# Altium schematic sheet BatteryCharger.SchDoc
size A3; SheetNumber: 2; SheetTotal: 5
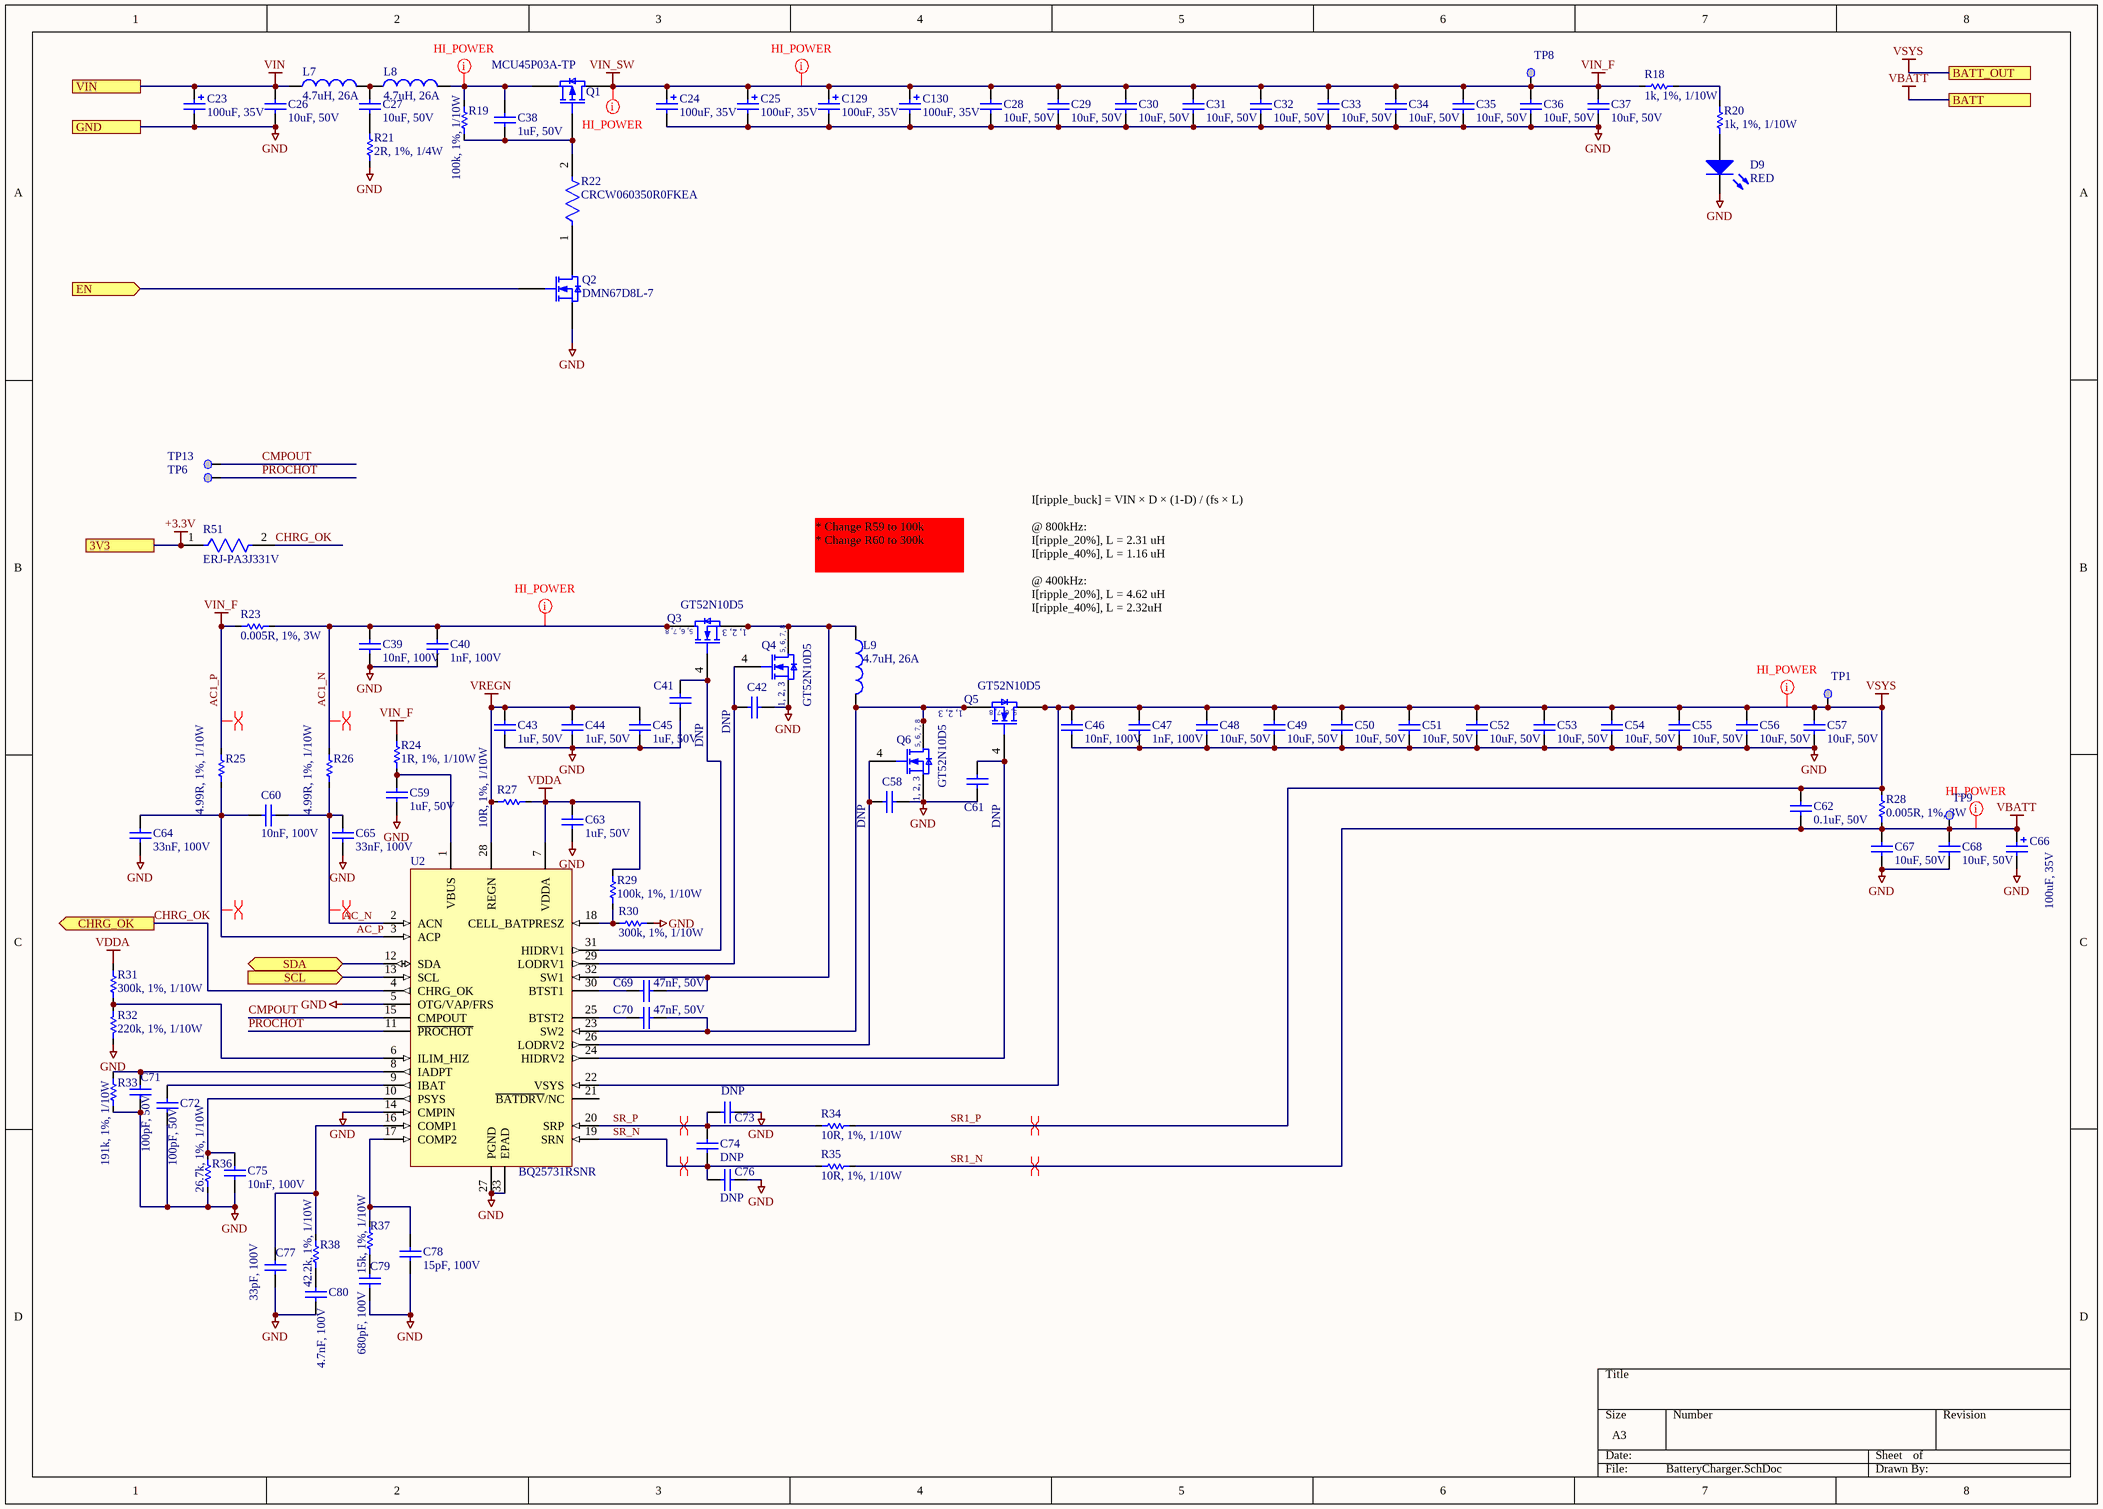
[diagram p0: BatteryCharger.SchDoc]

## Parts
C23  100uF, 35V  [CAPAE7866X80L]
C24  100uF, 35V  [CAPAE7866X80L]
C25  100uF, 35V  [CAPAE7866X80L]
C26  10uF, 50V  [1206]
C27  10uF, 50V  [1206]
C28  10uF, 50V  [1206]
C29  10uF, 50V  [1206]
C30  10uF, 50V  [1206]
C31  10uF, 50V  [1206]
C32  10uF, 50V  [1206]
C33  10uF, 50V  [1206]
C34  10uF, 50V  [1206]
C35  10uF, 50V  [1206]
C36  10uF, 50V  [1206]
C37  10uF, 50V  [1206]
C38  1uF, 50V  [0805]
C39  10nF, 100V  [0603]
C40  1nF, 100V  [0603]
C41  DNP  [0603]
C42  DNP  [0603]
C43  1uF, 50V  [0805]
C44  1uF, 50V  [0805]
C45  1uF, 50V  [0805]
C46  10nF, 100V  [0603]
C47  1nF, 100V  [0603]
C48  10uF, 50V  [1206]
C49  10uF, 50V  [1206]
C50  10uF, 50V  [1206]
C51  10uF, 50V  [1206]
C52  10uF, 50V  [1206]
C53  10uF, 50V  [1206]
C54  10uF, 50V  [1206]
C55  10uF, 50V  [1206]
C56  10uF, 50V  [1206]
C57  10uF, 50V  [1206]
C58  DNP  [0603]
C59  1uF, 50V  [0805]
C60  10nF, 100V  [0603]
C61  DNP  [0603]
C62  0.1uF, 50V  [0603]
C63  1uF, 50V  [0805]
C64  33nF, 100V  [0805_CAP]
C65  33nF, 100V  [0805_CAP]
C66  100uF, 35V  [CAPAE7866X80L]
C67  10uF, 50V  [1206]
C68  10uF, 50V  [1206]
C69  47nF, 50V  [0603]
C70  47nF, 50V  [0603]
C71  100pF, 50V  [0603]
C72  100pF, 50V  [0603]
C73  DNP  [0603]
C74  DNP  [0603]
C75  10nF, 100V  [0603]
C76  DNP  [0603]
C77  33pF, 100V  [0603]
C78  15pF, 100V  [0603]
C79  680pF, 100V  [0603]
C80  4.7nF, 100V  [0603]
C129  100uF, 35V  [CAPAE7866X80L]
C130  100uF, 35V  [CAPAE7866X80L]
D9  RED  [0603_DIODE_K1A2]
L7  4.7uH, 26A  [INDM178169X70N]
L8  4.7uH, 26A  [INDM178169X70N]
L9  4.7uH, 26A  [INDM178169X70N]
Q1  MCU45P03A-TP  [DPAK]
Q2  DMN67D8L-7  [SOT23-3]
Q3  GT52N10D5  [8-PowerSMD]
Q4  GT52N10D5  [8-PowerSMD]
Q5  GT52N10D5  [8-PowerSMD]
Q6  GT52N10D5  [8-PowerSMD]
R18  1k, 1%, 1/10W  [0603]
R19  100k, 1%, 1/10W  [0603]
R20  1k, 1%, 1/10W  [0603]
R21  2R, 1%, 1/4W  [1206]
R22  CRCW060350R0FKEA  [FP-CRCW0603-e3-IPC_A]
R23  0.005R, 1%, 3W  [2512_RES_1]
R24  1R, 1%, 1/10W  [0603]
R25  4.99R, 1%, 1/10W  [0603]
R26  4.99R, 1%, 1/10W  [0603]
R27  10R, 1%, 1/10W  [0603]
R28  0.005R, 1%, 3W  [2512_RES_1]
R29  100k, 1%, 1/10W  [0603]
R30  300k, 1%, 1/10W  [0603]
R31  300k, 1%, 1/10W  [0603]
R32  220k, 1%, 1/10W  [0603]
R33  191k, 1%, 1/10W  [0603]
R34  10R, 1%, 1/10W  [0603]
R35  10R, 1%, 1/10W  [0603]
R36  26.7k, 1%, 1/10W  [0603]
R37  15k, 1%, 1/10W  [0603]
R38  42.2k, 1%, 1/10W  [0603]
R51  ERJ-PA3J331V  [FP-ERJPA3-MFG]
TP1  Test Point  [TEST POINT 40 Mil]  (value not drawn)  (no BOM)
TP6  Test Point  [TEST POINT 40 Mil]  (value not drawn)  (no BOM)
TP8  Test Point  [TEST POINT 40 Mil]  (value not drawn)  (no BOM)
TP9  Test Point  [TEST POINT 40 Mil]  (value not drawn)  (no BOM)
TP13  Test Point  [TEST POINT 40 Mil]  (value not drawn)  (no BOM)
U2  BQ25731RSNR  [QFN40P400X400X80_HS-33L]

## Ports
3V3, BATT, BATT_OUT, CHRG_OK (out), EN (in), GND, SCL (in), SDA (bidir), VIN

## Nets
+3.3V: R51.1 ; port 3V3
AC1_P: C24.1 C25.1 C28.2 C29.2 C30.2 C31.2 C32.2 C33.2 C34.2 C35.2 C36.2 C37.2 C129.1 C130.1 Q1.2(D) R18.2 R23.1 R24.2 R25.2 TP8.1  [also labelled VIN_F, VIN_SW]
GND: C23.2 C24.2 C25.2 C26.1 C28.1 C29.1 C30.1 C31.1 C32.1 C33.1 C34.1 C35.1 C36.1 C37.1 C39.1 C40.1 C41.2 C42.2 C43.1 C44.1 C45.1 C46.1 C47.1 C48.1 C49.1 C50.1 C51.1 C52.1 C53.1 C54.1 C55.1 C56.1 C57.1 C58.2 C59.1 C61.2 C63.1 C64.1 C65.1 C66.2 C67.1 C68.1 C71.2 C72.1 C73.2 C75.1 C76.2 C77.1 C78.1 C79.1 C80.1 C129.2 C130.2 D9.2(K) Q2.2(S) Q4.1(S1) Q4.2(S2) Q4.3(S3) Q6.1(S1) Q6.2(S2) Q6.3(S3) R21.1 R30.1 R32.2 R33.1 R36.1 U2.5(OTG/VAP/FRS) U2.14(CMPIN) U2.27(PGND) U2.33(EPAD) ; port GND
SR1_N: C62.1 C66.1 C67.2 C68.2 R28.1 R35.2 TP9.1 ; port BATT  [also labelled VBATT]
SR1_P: C46.2 C47.2 C48.2 C49.2 C50.2 C51.2 C52.2 C53.2 C54.2 C55.2 C56.2 C57.2 C62.2 Q5.5(D1) Q5.6(D2) Q5.7(D3) Q5.8(D4) R28.2 R34.2 TP1.1 U2.22(VSYS) ; port BATT_OUT  [also labelled VSYS]
VDDA: C63.2 R27.2 R29.2 R31.2 U2.7(VDDA)
VIN: C23.1 C26.2 L7.1 ; port VIN
VREGN: C43.2 C44.2 C45.2 R27.1 U2.28(REGN)
AC1_N: C39.2 C40.2 Q3.5(D1) Q3.6(D2) Q3.7(D3) Q3.8(D4) R23.2 R26.2
AC_N: C60.1 C65.2 R26.1 U2.2(ACN)
AC_P: C60.2 C64.2 R25.1 U2.3(ACP)
CHRG_OK: R51.2 U2.4(CHRG_OK) ; port CHRG_OK
CMPOUT: TP13.1 U2.15(CMPOUT)
EN: Q2.1(G) ; port EN
PROCHOT: TP6.1 U2.11(~{PROCHOT})
SCL: U2.13(SCL) ; port SCL
SDA: U2.12(SDA) ; port SDA
SR_N: C74.1 C76.1 R35.1 U2.19(SRN)
SR_P: C73.1 C74.2 R34.1 U2.20(SRP)
NetC27_1: C27.1 R21.2
NetC27_2: C27.2 L7.2 L8.1
NetC38_1: C38.1 Q1.1(G) R19.1 R22.2
NetC38_2: C38.2 L8.2 Q1.3(S) R19.2
NetC41_1: C41.1 Q3.4(G) U2.31(HIDRV1)
NetC42_1: C42.1 Q4.4(G) U2.29(LODRV1)
NetC58_1: C58.1 Q6.4(G) U2.26(LODRV2)
NetC59_2: C59.2 R24.1 U2.1(VBUS)
NetC61_1: C61.1 Q5.4(G) U2.24(HIDRV2)
NetC69_1: C69.1 L9.1 Q3.1(S1) Q3.2(S2) Q3.3(S3) Q4.5(D1) Q4.6(D2) Q4.7(D3) Q4.8(D4) U2.32(SW1)
NetC69_2: C69.2 U2.30(BTST1)
NetC70_1: C70.1 L9.2 Q5.1(S1) Q5.2(S2) Q5.3(S3) Q6.5(D1) Q6.6(D2) Q6.7(D3) Q6.8(D4) U2.23(SW2)
NetC70_2: C70.2 U2.25(BTST2)
NetC71_1: C71.1 R33.2 U2.8(IADPT)
NetC72_2: C72.2 U2.9(IBAT)
NetC75_2: C75.2 R36.2 U2.10(PSYS)
NetC77_2: C77.2 R38.2 U2.16(COMP1)
NetC78_2: C78.2 R37.2 U2.17(COMP2)
NetC79_2: C79.2 R37.1
NetC80_2: C80.2 R38.1
NetD9_1: D9.1(A) R20.2
NetQ2_3: Q2.3(D) R22.1
NetR18_1: R18.1 R20.1
NetR29_1: R29.1 R30.2 U2.18(CELL_BATPRESZ)
NetR31_1: R31.1 R32.1 U2.6(ILIM_HIZ)

Not connected (* = marked no-connect by the designer): U2 21(~{BATDRV}/NC)

## Layout directives
differential pair: AC1_N, AC1_P, AC_N, AC_P, SR1_N, SR1_P, SR_N, SR_P
net class HI_POWER: AC1_N, AC1_P, NetC38_2, SR1_N, SR1_P

## Notes on the sheet
- * Change R59 to 100k
  * Change R60 to 300k
- I[ripple_buck] = VIN × D × (1-D) / (fs × L)
  @ 800kHz:
  I[ripple_20%], L = 2.31 uH
  I[ripple_40%], L = 1.16 uH
  @ 400kHz:
  I[ripple_20%], L = 4.62 uH
  I[ripple_40%], L = 2.32uH
- (in symbol NS00856) 5, 6, 7, 8; 1, 2, 3

## Library data of the parts
C23-C25 C66 C129 C130 = NS00911: CAP ALUM 100UF 20% 35V SMD; Type: C; Alternatives: Generic; Part Number: NS00911; Value: 100uF, 35V; Supplier 1: Digi-Key; Supplier Part Number 1: PCE5051CT-ND
C26-C37 C48-C57 C67 C68 = NS00832: CAP CER 10UF 50V X7R 1206; Type: C; Alternatives: Generic; Part Number: NS00832; Value: 10uF, 50V; Supplier 1: Digi-Key; Supplier Part Number 1: 1276-6767-1-ND
C38 C43-C45 C59 C63 = NS00871: CAP CER 1UF 50V X7R 0805; Type: C; Alternatives: Generic; Part Number: NS00871; Value: 1uF, 50V; Supplier 1: Digi-Key; Supplier Part Number 1: 1276-6470-1-ND
C39 C46 C60 C75 = NS00848: CAP CER 10000PF 100V C0G 0603; Type: C; Alternatives: Generic; Part Number: NS00848; Value: 10nF, 100V; Supplier 1: Digi-Key; Supplier Part Number 1: 445-172665-1-ND
C40 C47 = NS00847: CAP CER 1000PF 100V C0G/NP0 0603; Type: C; Alternatives: Generic; Part Number: NS00847; Value: 1nF, 100V; Supplier 1: Digi-Key; Supplier Part Number 1: 732-12187-1-ND
C41 C42 C58 C61 = NS00840: CAP CER 100PF 50V C0G/NP0 0603; Type: C; Value: 100pF, 50V; Alternatives: Generic; Part Number: NS00840; Supplier 1: Digi-Key; Supplier Part Number 1: 478-1175-1-ND
C62 = NS00838: CAP CER 0.1UF 50V X7R 0603; Type: C; Alternatives: Generic; Part Number: NS00838; Value: 0.1uF, 50V; Supplier 1: Digi-Key; Supplier Part Number 1: 1276-1935-1-ND
C64 C65 = NS00800: CAP CER 0.033UF 100V C0G 0805; Type: C; Alternatives: Generic; Part Number: NS00800; Value: 33nF, 100V; Supplier 1: Digi-Key; Supplier Part Number 1: 445-172691-1-ND
C69 C70 = NS00804: CAP CER 0.047UF 50V X7R 0603; Type: C; Alternatives: Generic; Part Number: NS00804; Value: 47nF, 50V; Supplier 1: Digi-Key; Supplier Part Number 1: 1276-1063-1-ND
C71 C72 = NS00840: CAP CER 100PF 50V C0G/NP0 0603; Type: C; Alternatives: Generic; Part Number: NS00840; Value: 100pF, 50V; Supplier 1: Digi-Key; Supplier Part Number 1: 478-1175-1-ND
C73 C74 C76 = NS00895: CAP CER 0.068UF 50V X7R 0603; Type: C; Value: 68nF, 50V; Alternatives: Generic; Part Number: NS00895; Supplier 1: Digi-Key; Supplier Part Number 1: 1276-6541-1-ND
C77 = NS00931: CAP CER 33PF 100V C0G/NP0 0603; Type: C; Alternatives: Generic; Part Number: NS00931; Value: 33pF, 100V; Supplier 1: Digi-Key; Supplier Part Number 1: 399-15919-1-ND
C78 = NS00932: CAP CER 15PF 100V C0G/NP0 0603; Type: C; Alternatives: Generic; Part Number: NS00932; Value: 15pF, 100V; Supplier 1: Digi-Key; Supplier Part Number 1: 1276-CL10C150JC81PNCCT-ND
C79 = NS00933: CAP CER 680PF 100V C0G 0603; Type: C; Alternatives: Generic; Part Number: NS00933; Value: 680pF, 100V; Supplier 1: Digi-Key; Supplier Part Number 1: 445-5734-1-ND
C80 = NS00930: CAP CER 4700PF 100V C0G 0603; Type: C; Alternatives: Generic; Part Number: NS00930; Value: 4.7nF, 100V; Supplier 1: Digi-Key; Supplier Part Number 1: 445-172684-1-ND
D9 = NS00945: LED RED CLEAR 1608 SMD; Type: IC; Part Number: NS00945; Value: RED; ComponentLink1Description: Datasheet; ComponentLink1URL: H:\Doc\Harvatek\B1911USD-20D000114U1930.pdf; Supplier 1: Digi-Key; Supplier Part Number 1: 3147-B1911USD-20D000114U1930CT-ND
L7-L9 = NS00854: FIXED IND 4.7UH 26A 5.5 MOHM SMD; Part Number: NS00854; Type: Inductor; Value: 4.7uH, 26A; ComponentLink1Description: Datasheet; ComponentLink1URL: H:\Doc\Bourns\srp1770c.pdf; Supplier 1: Digi-Key; Supplier Part Number 1: SRP1770C-4R7MCT-ND
Q1 = NS00810: P-CHANNEL MOSFET, DPAK; Type: IC; Part Number: NS00810; Value: MCU45P03A-TP; ComponentLink1Description: Datasheet; ComponentLink1URL: H:\Doc\MicroCommercial\MCU45P03A(DPAK).pdf; Supplier 1: Digi-Key; Supplier Part Number 1: 353-MCU45P03A-TPCT-ND
Q2 = NS00873: MOSFET N-CH 60V 210MA SOT23; Type: IC; Published: 8-Jun-2000; LatestRevisionDate: 17-Jul-2002; LatestRevisionNote: Re-released for DXP Platform.; PackageVersion: 1995/1996; PackageReference: E3; Publisher: Altium Limited; Part Number: NS00873; Value: DMN67D8L-7; ComponentLink1Description: Datasheet; ComponentLink1URL: H:\Doc\Diodes\DMN67D8L.pdf; Supplier 1: Digi-Key; Supplier Part Number 1: DMN67D8L-7DICT-ND
Q3-Q6 = NS00856: N-CH MOSFET 100V 71A 8-PowerTDFN; Type: IC; Published: 8-Jun-2000; LatestRevisionDate: 17-Jul-2002; LatestRevisionNote: Re-released for DXP Platform.; PackageVersion: 1995/1996; PackageReference: E3; Publisher: Altium Limited; Part Number: NS00856; Value: GT52N10D5; ComponentLink1Description: Datasheet; ComponentLink1URL: H:\Doc\Goford\GOFORD GT52N10D5.pdf; Supplier 1: Digi-Key; Supplier Part Number 1: 3141-GT52N10D5CT-ND
R18 R20 = NS00882: RES 1K OHM 1% 1/10W 0603; Alternatives: Generic; Part Number: NS00882; Type: R; Value: 1k, 1%, 1/10W; Supplier 1: Digi-Key; Supplier Part Number 1: RMCF0603FT1K00CT-ND
R19 R29 = NS00835: RES 100K OHM 1% 1/10W 0603; Alternatives: Generic; Part Number: NS00835; Type: R; Value: 100k, 1%, 1/10W; Supplier 1: Digi-Key; Supplier Part Number 1: RMCF0603FT100KCT-ND
R21 = NS00946: RES 2 OHM 1% 1/4W 1206; Alternatives: Generic; Part Number: NS00946; Type: R; Value: 2R, 1%, 1/4W; Supplier 1: Digi-Key; Supplier Part Number 1: 738-RMCF1206FT2R00CT-ND
R22 = CMP-2000-03436-2: RES Thick Film, 50Ω, 1%, 0.1W, 100ppm/°C, 0603; Voltage Rating (DC): 75V; Resistance: 50R; Power Rating: 100mW; Case/Package: 0603; Packaging: Tape and Reel; Military Standard: Not; REACH SVHC: No SVHC; Width: 0.85mm; Max Operating Temperature: 155°C; Case Code (Metric): 1608; Temperature Coefficient: 100ppm/°C; Lead Free: Lead Free; Height: 0.45mm; Composition: Thick Film; Termination: SMD/SMT; Contact Plating: Tin; Number of Pins: 2; Tolerance: 1%; Depth: 0.85mm; Weight: 7.1E-05oz; Min Operating Temperature: -55°C; Length: 1.55mm; Radiation Hardening: No; Voltage Rating: 75V; Case Code (Imperial): 0603; Package Quantity: 5000; Mount: Surface Mount
R23 R28 = NS00798: RES 0.005 OHM 1% 3W 2512; Alternatives: Generic; Part Number: NS00798; Type: R; Value: 0.005R, 1%, 3W; Supplier 1: Digi-Key; Supplier Part Number 1: CRE2512-FZ-R005E-3CT-ND
R24 = NS00811: RES 1 OHM 1% 1/10W 0603; Alternatives: Generic; Part Number: NS00811; Type: R; Value: 1R, 1%, 1/10W; Supplier 1: Digi-Key; Supplier Part Number 1: RMCF0603FT1R00CT-ND
R25 R26 = NS00799: RES 4.99 OHM 1% 1/10W 0603; Alternatives: Generic; Part Number: NS00799; Type: R; Value: 4.99R, 1%, 1/10W; Supplier 1: Digi-Key; Supplier Part Number 1: RMCF0603FT4R99CT-ND
R27 R34 R35 = NS00796: RES 10 OHM 1% 1/10W 0603; Alternatives: Generic; Part Number: NS00796; Type: R; Value: 10R, 1%, 1/10W; Supplier 1: Digi-Key; Supplier Part Number 1: 1292-WR06X10R0FTLCT-ND
R30 R31 = NS00837: RES 300K OHM 1% 1/10W 0603; Alternatives: Generic; Part Number: NS00837; Type: R; Value: 300k, 1%, 1/10W; Supplier 1: Digi-Key; Supplier Part Number 1: RMCF0603FT300KCT-ND
R32 = NS00915: RES SMD 220K OHM 1% 1/10W 0603; Alternatives: Generic; Part Number: NS00915; Type: R; Value: 220k, 1%, 1/10W; Supplier 1: Digi-Key; Supplier Part Number 1: YAG3579CT-ND
R33 = NS00821: RES 191K OHM 1% 1/10W 0603; Alternatives: Generic; Part Number: NS00821; Type: R; Value: 191k, 1%, 1/10W; Supplier 1: Digi-Key; Supplier Part Number 1: RMCF0603FT191KCT-ND
R36 = NS00823: RES 26.7K OHM 1% 1/10W 0603; Alternatives: Generic; Part Number: NS00823; Type: R; Value: 26.7k, 1%, 1/10W; Supplier 1: Digi-Key; Supplier Part Number 1: RMCF0603FT26K7
R37 = NS00834: RES 15K OHM 1% 1/10W 0603; Alternatives: Generic; Part Number: NS00834; Type: R; Value: 15k, 1%, 1/10W; Supplier 1: Digi-Key; Supplier Part Number 1: 1292-WR06X1502FTLCT-ND
R38 = NS00822: RES 42.2K OHM 1% 1/10W 0603; Alternatives: Generic; Part Number: NS00822; Type: R; Value: 42.2k, 1%, 1/10W; Supplier 1: Digi-Key; Supplier Part Number 1: RMCF0603FT42K2
R51 = CMP-05422-000096-1: RES SMD 330 OHM 5% 1/4W 0603; Resistance: 330R; Temperature Coefficient: 200ppm/°C; Max Power Dissipation: 250mW; Case Code (Imperial): 0603; Height: 0.018inch; Case/Package: 0603; Case Code (Metric): 1608; Width: 0.031inch; Length: 0.063inch; Tolerance: 5%; Features: Automotive AEC-Q200; Min Operating Temperature: -55°C; Max Operating Temperature: 155°C; Resistor Type: Thick Film; Packaging: Cut Tape; Number of Terminations: 2; Parameter 1: *; Parameter 2: *
TP1 TP6 TP8 TP9 TP13 = Test Point: Test Point 0.3mm; PartType: Mechanical; ComponentLink1Description: Datasheet
U2 = NS00795: I2C 1-5 CELL NVDC BUCK-BOOST BAT; Part Number: NS00795; Type: IC; Value: BQ25731RSNR; ComponentLink1Description: Datasheet; ComponentLink1URL: H:\Doc\TI\bq25731.pdf; ComponentLink2Description: Application Notes; ComponentLink2URL: H:\Doc\TI\sluucb9a.pdf; Supplier 1: Digi-Key; Supplier Part Number 1: 296-BQ25731RSNRCT-ND